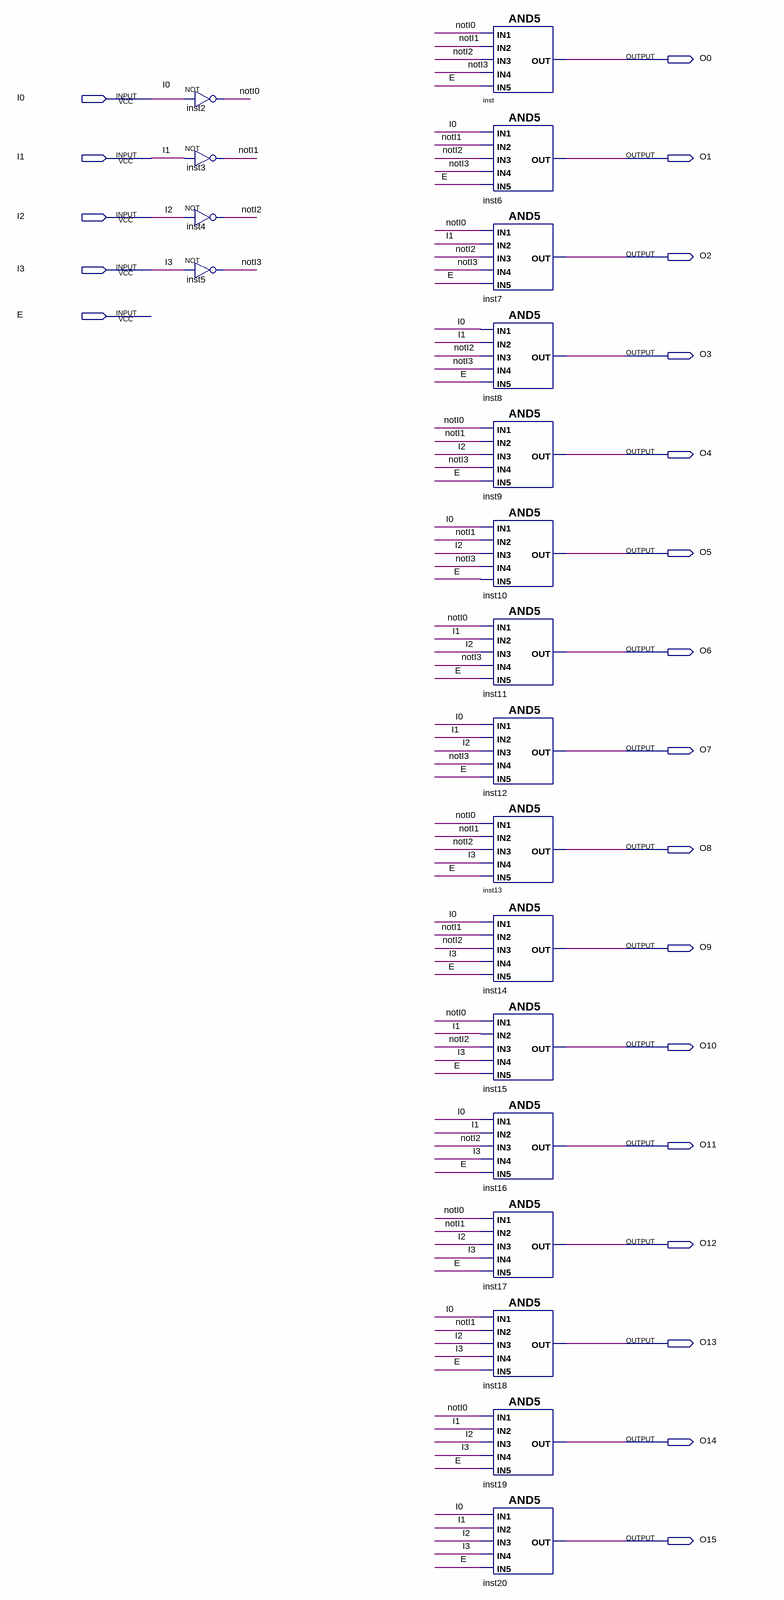
[diagram p0: schematic sheet]
// Quartus schematic DC4_16.bdf as structural Verilog: 20 symbols, 21 pins
module DC4_16 (
  input  I0,
  input  I1,
  input  I2,
  input  I3,
  input  E,
  output O0,
  output O1,
  output O2,
  output O3,
  output O4,
  output O5,
  output O6,
  output O7,
  output O8,
  output O9,
  output O10,
  output O11,
  output O12,
  output O13,
  output O14,
  output O15
);

  wire notI0, notI1, notI2, notI3;

  not inst2 (notI0, I0);
  not inst3 (notI1, I1);
  not inst4 (notI2, I2);
  not inst5 (notI3, I3);
  and inst (O0, notI0, notI1, notI2, notI3, E);
  and inst6 (O1, I0, notI1, notI2, notI3, E);
  and inst7 (O2, notI0, I1, notI2, notI3, E);
  and inst8 (O3, I0, I1, notI2, notI3, E);
  and inst9 (O4, notI0, notI1, I2, notI3, E);
  and inst10 (O5, I0, notI1, I2, notI3, E);
  and inst11 (O6, notI0, I1, I2, notI3, E);
  and inst12 (O7, I0, I1, I2, notI3, E);
  and inst13 (O8, notI0, notI1, notI2, I3, E);
  and inst14 (O9, I0, notI1, notI2, I3, E);
  and inst15 (O10, notI0, I1, notI2, I3, E);
  and inst16 (O11, I0, I1, notI2, I3, E);
  and inst17 (O12, notI0, notI1, I2, I3, E);
  and inst18 (O13, I0, notI1, I2, I3, E);
  and inst19 (O14, notI0, I1, I2, I3, E);
  and inst20 (O15, I0, I1, I2, I3, E);
endmodule
